# EAGLE design main_board (EAGLE 9.3.0)
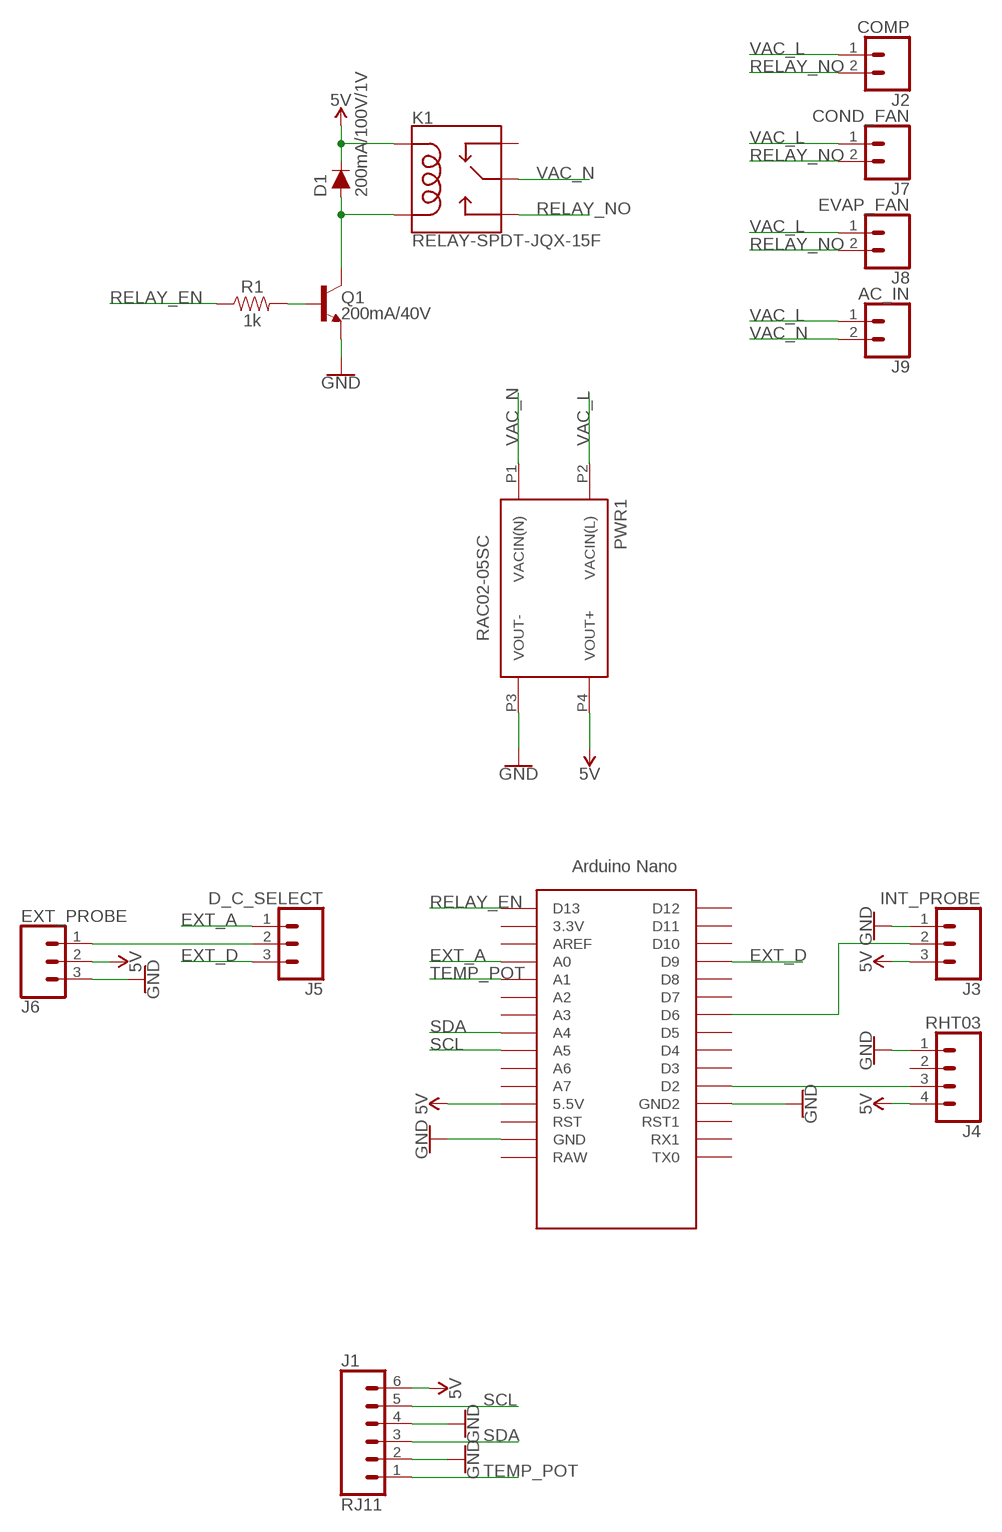
[diagram p0: schematic, sheet 1]

## Parts
D1  200mA/100V/1V  DIODE-1N4148  [DIODE-1N4148]
J1  RJ11  RJ11-6  [RJ11-6]
J2  COMP  CONN_025MM  [SCREWTERMINAL-5MM-2]
J3  INT_PROBE  CONN_03  [1X03]
J4  RHT03  CONN_04  [1X04]
J5  D_C_SELECT  CONN_03  [1X03]
J6  EXT_PROBE  CONN_03  [1X03]
J7  COND_FAN  CONN_025MM  [SCREWTERMINAL-5MM-2]
J8  EVAP_FAN  CONN_025MM  [SCREWTERMINAL-5MM-2]
J9  AC_IN  CONN_025MM  [SCREWTERMINAL-5MM-2]
K1  RELAY-SPDT-JQX-15F  [RELAY-T90]
PWR1  RAC02-05SC  [LOW_PROFILE_POWER_MODULE]
Q1  200mA/40V  TRANS_NPN-2N3904  [TO-92]
R1  1k  1KOHM-HORIZ-1/4W-1%  [AXIAL-0.3]
U$1  NANO  [NANO]

## Nets
5V: D1.C J1.6 J3.3 J4.4 J6.2 K1.COIL1 PWR1.P4(VOUT+) U$1.5V(5.5V)
EXT_A: J5.1 U$1.A0
EXT_D: J5.3 U$1.D9
GND: J1.2 J1.4 J3.1 J4.1 J6.3 PWR1.P3(VOUT-) Q1.1(E) U$1.GND U$1.GND1(GND2)
N$1: Q1.2(B) R1.P$2
N$2: D1.A K1.COIL2 Q1.3(C)
N$3: J4.3 U$1.D2
N$4: J3.2 U$1.D6
N$7: J5.2 J6.1
RELAY_EN: R1.P$1 U$1.D13
RELAY_NO: J2.2 J7.2 J8.2 K1.NO
SCL: J1.5 U$1.A5
SDA: J1.3 U$1.A4
TEMP_POT: J1.1 U$1.A1
VAC_L: J2.1 J7.1 J8.1 J9.1 PWR1.P2(VACIN(L))
VAC_N: J9.2 K1.MAIN PWR1.P1(VACIN(N))
Unconnected: J4.2 K1.NC U$1.3.3V U$1.A2 U$1.A3 U$1.A6 U$1.A7 U$1.AREF U$1.D3 U$1.D4 U$1.D5 U$1.D7 U$1.D8 U$1.D10 U$1.D11 U$1.D12 U$1.ICSP1 U$1.ICSP2 U$1.ICSP3 U$1.ICSP4 U$1.ICSP5 U$1.ICSP6 U$1.RAW U$1.RST U$1.RST1 U$1.RX1 U$1.TX0

## Library data of the parts
D1 = SparkFun-DiscreteSemi:DIODE: Diode These are standard reverse protection diodes and small signal diodes. SparkFun Products: SparkFun SparkPunk Sound Kit <https://www.sparkfun.com/products/11177> SparkFun ESP8266 Thing <https://www.sparkfun.com/products/13231>; PROD_ID: DIO-08378
J1 = SparkFun-Connectors:RJ11-6: RJ11 Jack - 6 pin Commonly found on CAT3 devices and some Microchip programmers. Here is the connector we sell at SparkFun: RJ11 6-Pin Connector <https://www.sparkfun.com/products/132> (PRT-00132) Datasheet <http://www.sparkfun.com/datasheets/Prototyping/Connectors/RJ11-Datasheet.pdf> It is used on this SparkFun product: SparkFun Weather Shield <https://www.sparkfun.com/products/12081> (DEV-12081) Weather Meters <https://www.sparkfun.com/products/8942> (SEN-08942); PROD_ID: CONN-08590; SF_ID: PRT-00132
J2 J7-J9 = SparkFun-Connectors:CONN_02: Multi connection point. Often used as Generic Header-pin footprint for 0.1 inch spaced/style header connections On any of the 0.1 inch spaced packages, you can populate with these: Break Away Headers - Straight <https://www.sparkfun.com/products/116> (PRT-00116) Break Away Male Headers - Right Angle <https://www.sparkfun.com/products/553> (PRT-00553) Female Headers <https://www.sparkfun.com/products/115> (PRT-00115) Break Away Headers - Machine Pin <https://www.sparkfun.com/products/117> (PRT-00117) Break Away Female Headers - Swiss Machine Pin <https://www.sparkfun.com/products/743> (PRT-00743) For SCREWTERMINALS and SPRING TERMINALS visit here: Screw Terimnals on SparkFun.com <https://www.sparkfun.com/search/results?term=Screw+Terminals> (5mm/3.5mm/2.54mm spacing) This device is also useful as a general connection point to wire up your design to another part of your project. Our various solder wires solder well into these plated through hole pads. Hook-Up Wire - Assortment (Stranded, 22 AWG) <https://www.sparkfun.com/products/11375> (PRT-11375) Hook-Up Wire - Assortment (Solid Core, 22 AWG) <https://www.sparkfun.com/products/11367> (PRT-11367) View the entire wire category on our website here <https://www.sparkfun.com/categories/141> Special notes: Molex polarized connector foot print use with: PRT-08233 with associated crimp pins and housings. 2.54_SCREWTERM for use with PRT-10571. 3.5mm Screw Terminal footprints for PRT-08084 5mm Screw Terminal footprints for use with PRT-08432; SF_SKU: PRT-08432
J3 J5 J6 = SparkFun-Connectors:CONN_03: Multi connection point. Often used as Generic Header-pin footprint for 0.1 inch spaced/style header connections On any of the 0.1 inch spaced packages, you can populate with these: Break Away Headers - Straight <https://www.sparkfun.com/products/116> (PRT-00116) Break Away Male Headers - Right Angle <https://www.sparkfun.com/products/553> (PRT-00553) Female Headers <https://www.sparkfun.com/products/115> (PRT-00115) Break Away Headers - Machine Pin <https://www.sparkfun.com/products/117> (PRT-00117) Break Away Female Headers - Swiss Machine Pin <https://www.sparkfun.com/products/743> (PRT-00743) Stackable Header - 3 Pin (Female, 0.1") <https://www.sparkfun.com/products/13875> (PRT-13875) For SCREWTERMINALS and SPRING TERMINALS visit here: Screw Terimnals on SparkFun.com <https://www.sparkfun.com/search/results?term=Screw+Terminals> (5mm/3.5mm/2.54mm spacing) This device is also useful as a general connection point to wire up your design to another part of your project. Our various solder wires solder well into these plated through hole pads. Hook-Up Wire - Assortment (Stranded, 22 AWG) <https://www.sparkfun.com/products/11375> (PRT-11375) Hook-Up Wire - Assortment (Solid Core, 22 AWG) <https://www.sparkfun.com/products/11367> (PRT-11367) View the entire wire category on our website here <https://www.sparkfun.com/categories/141> Special notes: Molex polarized connector foot print use with SKU : PRT-08232 with associated crimp pins and housings.; PROD_ID: XXX-00000; VALUE: 455-1750-1-ND
J4 = SparkFun-Connectors:CONN_04: Multi connection point. Often used as Generic Header-pin footprint for 0.1 inch spaced/style header connections On any of the 0.1 inch spaced packages, you can populate with these: Break Away Headers - Straight <https://www.sparkfun.com/products/116> (PRT-00116) Break Away Male Headers - Right Angle <https://www.sparkfun.com/products/553> (PRT-00553) Female Headers <https://www.sparkfun.com/products/115> (PRT-00115) Break Away Headers - Machine Pin <https://www.sparkfun.com/products/117> (PRT-00117) Break Away Female Headers - Swiss Machine Pin <https://www.sparkfun.com/products/743> (PRT-00743) For SCREWTERMINALS and SPRING TERMINALS visit here: Screw Terimnals on SparkFun.com <https://www.sparkfun.com/search/results?term=Screw+Terminals> (5mm/3.5mm/2.54mm spacing) This device is also useful as a general connection point to wire up your design to another part of your project. Our various solder wires solder well into these plated through hole pads. Hook-Up Wire - Assortment (Stranded, 22 AWG) <https://www.sparkfun.com/products/11375> (PRT-11375) Hook-Up Wire - Assortment (Solid Core, 22 AWG) <https://www.sparkfun.com/products/11367> (PRT-11367) View the entire wire category on our website here <https://www.sparkfun.com/categories/141> Special notes: Molex polarized connector foot print use with SKU : PRT-08231 with associated crimp pins and housings. 1MM SMD Version SKU: PRT-10208; PROD_ID: CONN-09696
K1 = SparkFun-Electromechanical:RELAY-SPDT: SPDT Electromechanical Relay Single-pole, double-throw sealed relays. When current is applied to the coil, it throws a simple changeover switch, terminating the connection from the NC contact to ground and closing the NO contact. Use them to switch high voltage/high current devices. SparkFun Products JQX-15F: Relay SPDT Sealed - 20A <https://www.sparkfun.com/products/10924> (COM-10924) JZC-11F: Relay SPDT Sealed <https://www.sparkfun.com/products/100> (COM-00100); PROD_ID: COMP-10736; SF_SKU: COM-10924
PWR1 = recom-powerline-acdc-converters:RAC*SC: RECOM POWERLINE AC/DC-Converter (RAC01-SC and RAC02-SC series) The RAC01-SC and RAC02-SC series are ultra-compact universal input AC/DC power modules for PCB mounting. They feature high efficiency, low standby power, high operating temperature, soft start and short-circuit protection as well as a built-in EMC Class B filter. Output voltages range from 3.3VDC to 24VDC. Datasheet <http://www.recom-power.com/pdf/Powerline-AC-DC/RAC01_02-SC.pdf>; INPUT_RANGE: 80 - 277 (VAC); MAX_CAPACITIVE_LOAD: 1200uF; OUTPUT_CURRENT: 400mA; OUTPUT_VOLTAGE: 5v
Q1 = SparkFun-DiscreteSemi:TRANS_NPN: NPN transistor Current controlled devices typically used to amplify current or used as a switch. BC547 - COM-08928 <http://www.sparkfun.com/products/8928> (TO-92 45V 100mA) (1.Collector 2.Base 3.Emitter) 2N3904 - COM-00521 <http://www.sparkfun.com/products/521> (TO-92 40V 200mA) (1.Emitter 2.Base 3.Collector) P2N2222A - COM-12852 <http://www.sparkfun.com/products/12852> (TO-92 40V 600mA) (1.Collector 2.Base 3.Emitter); PROD_ID: TRANS-08447
R1 = SparkFun-Resistors:1KOHM: 1kΩ resistor A resistor is a passive two-terminal electrical component that implements electrical resistance as a circuit element. Resistors act to reduce current flow, and, at the same time, act to lower voltage levels within circuits. - Wikipedia; PROD_ID: RES-12182
U$1 = Arduino-clone:NANO: Arduino Nano

## Board
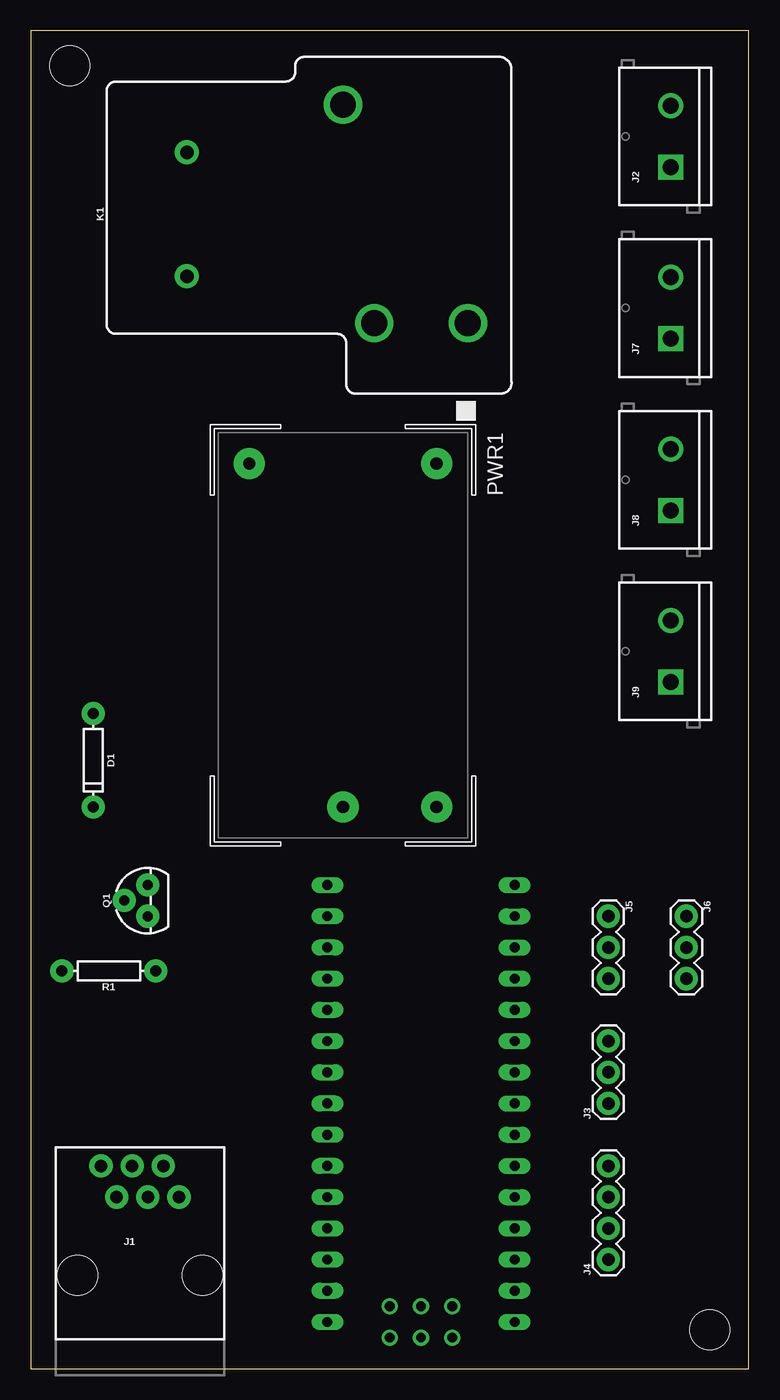
[diagram p1: board, top side]
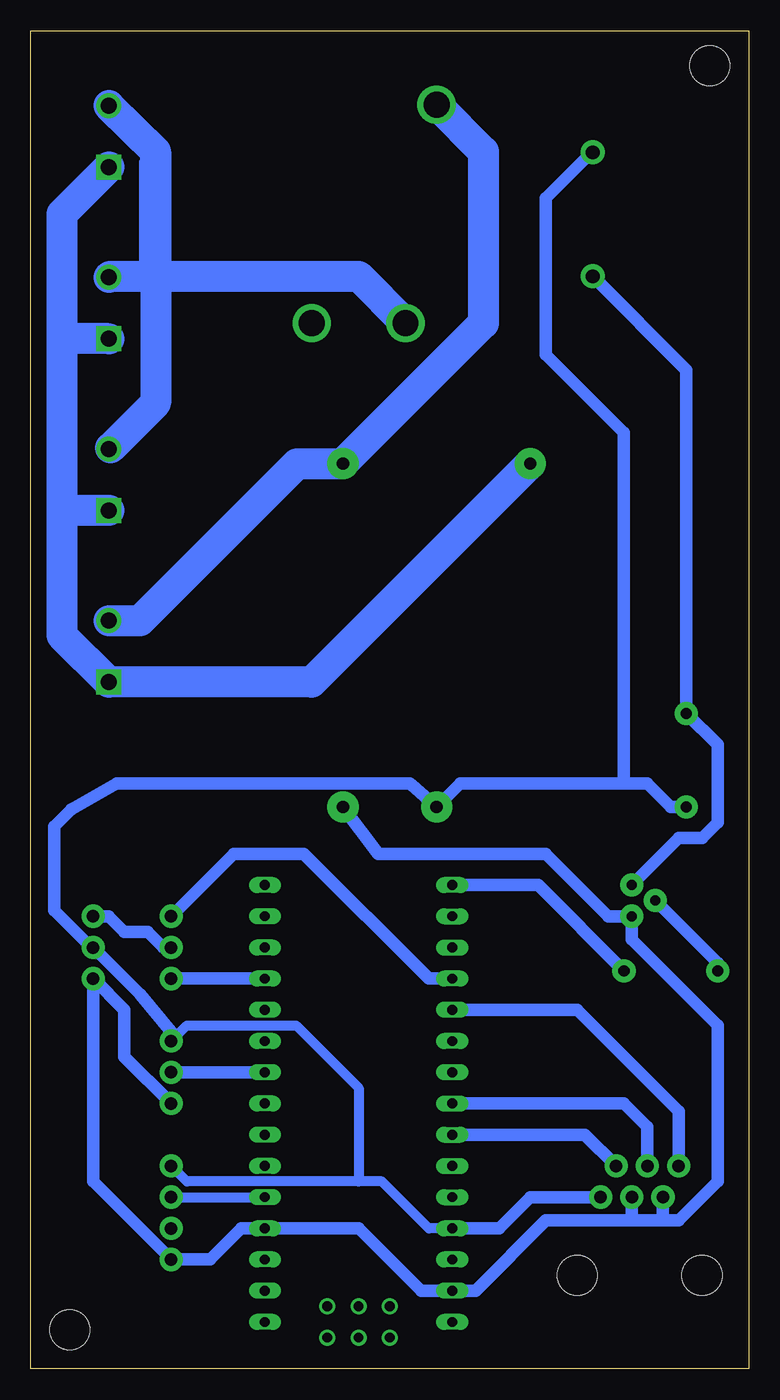
[diagram p2: board, bottom side, seen from below]

Size 58.4 x 108.89 mm. Coordinates in mm from the lower left corner, seen from the top.
Outline: 0,0 58.4,0 58.4,108.89 0,108.89 0,0
Copper layers (1*16): Top 0.035mm / dielectric 1.5mm / Bottom 0.035mm
Design rules "default": minimum track width 6mil, minimum drill 0.35mm, track to track 6mil, track to pad 6mil, pad to pad 6mil, via to via 6mil, smd to smd 6mil, copper to edge 40mil, drill to drill 6mil, minimum pad ring 10mil, minimum via ring 8mil, stop-mask expansion 4mil, vias tented up to drill 0mil, thermal gap 10mil
Holes 3.25 mm at 55.24,3.17 3.17,106.05

### Footprints (pad centres in the part's own frame; a part is rotated, then mirrored left to right if it is on the bottom)
DIODE-1N4148 = drill 0.9 pad 1.88: A -3.81,0; C 3.81,0
RJ11-6 = drill 1.016 pad 1.88: 1 -3.175,8.89; 2 -1.905,6.35; 3 -0.635,8.89; 4 0.635,6.35; 5 1.905,8.89; 6 3.175,6.35 | hole 3.251: -5.08,0; 5.08,0
SCREWTERMINAL-5MM-2 = drill 1.3 pad 2.032 square: 1 0,0 | drill 1.3 pad 2.032: 2 5,0
1X03 = drill 1.016 pad 1.88: 1 0,0; 2 2.54,0; 3 5.08,0
1X04 = drill 1.016 pad 1.88: 1 0,0; 2 2.54,0; 3 5.08,0; 4 7.62,0
RELAY-T90 = drill 1.1 pad 1.956: COIL1 0,-13.9; COIL2 0,-3.81 | drill 2.1: MAIN -12.7,-17.78; NC -22.86,0; NO -15.24,0
LOW_PROFILE_POWER_MODULE = drill 1 pad 2.54: P1 -12.7,7.62; P2 -12.7,-7.62; P3 15.24,7.62; P4 15.24,0
TO-92 = drill 0.813 pad 1.88: 1 -1.27,0; 2 0,1.905; 3 1.27,0
AXIAL-0.3 = drill 0.9 pad 1.88: P$1 -3.81,0; P$2 3.81,0
NANO = drill 0.8 long: 3.3V -10.16,24.13; 5V -10.16,-1.27; A0 -10.16,19.05; A1 -10.16,16.51; A2 -10.16,13.97; A3 -10.16,11.43; A4 -10.16,8.89; A5 -10.16,6.35; A6 -10.16,3.81; A7 -10.16,1.27; AREF -10.16,21.59; D2 5.08,1.27; D3 5.08,3.81; D4 5.08,6.35; D5 5.08,8.89; D6 5.08,11.43; D7 5.08,13.97; D8 5.08,16.51; D9 5.08,19.05; D10 5.08,21.59; D11 5.08,24.13; D12 5.08,26.67; D13 -10.16,26.67; GND -10.16,-6.35; GND1 5.08,-1.27; RAW -10.16,-8.89; RST -10.16,-3.81; RST1 5.08,-3.81; RX1 5.08,-6.35; TX0 5.08,-8.89 | drill 0.8: ICSP1 -5.08,-10.16; ICSP2 -5.08,-7.62; ICSP3 -2.54,-10.16; ICSP4 -2.54,-7.62; ICSP5 0,-10.16; ICSP6 0,-7.62

### Placement (x,y rotation side)
D1  5.08,49.53 270 top
DRILEGEND  [DRILEGEND]  0,-4.42 0 top  (outside the outline)
J1  8.89,7.62 0 top
J2  52.07,97.79 90 top
J3  46.99,21.59 90 top
J4  46.99,8.89 90 top
J5  46.99,36.83 270 top
J6  53.34,36.83 270 top
J7  52.07,83.82 90 top
J8  52.07,69.85 90 top
J9  52.07,55.88 90 top
K1  12.7,85.09 180 top
PWR1  25.4,60.96 270 top
Q1  9.53,38.1 90 top
R1  6.35,32.38 180 top
U$1  34.29,12.7 0 top

### Tracks (layer width: path | path; a pad name or v marks a point on that pad's centre or on a via)
5V
  Bottom 0.152: 53.49,34.29 J6.2 | 25.45,45.72 PWR1.P4
  Bottom 0.254: K1.COIL1 12.77,98.99 | 27.42,47.49 27.58,47.62 | 55.13,45.52 55.24,45.45
  Bottom 0.813: U$1.5V 26.04,11.43 29.84,15.24 31.75,15.24 | J4.4 45.72,15.24 31.75,15.24 | J3.3 45.72,27.94 36.83,27.94 31.75,22.86 31.75,15.24
  Bottom 1.016: 12.77,98.99 16.51,95.25 16.51,82.55 10.16,76.2 10.16,47.62 | D1.C 6.35,45.72 8.26,47.62 10.16,47.62 | 10.16,47.62 23.5,47.62 PWR1.P4 27.42,47.49 | U$1.5V 20.32,11.43 17.78,13.97 J1.6 | J6.2 49.53,30.48 46.99,27.43 J3.3 | 27.58,47.62 51.44,47.62 55.13,45.52 56.52,44.13 56.52,37.31 53.49,34.29
EXT_A
  Bottom 1.016: U$1.A0 26.04,31.75 36.2,41.91 41.91,41.91 J5.1
EXT_D
  Bottom 1.016: U$1.D9 J5.3
GND
  Bottom 0.152: 9.6,36.88 Q1.1
  Bottom 1.016: J3.1 50.8,25.4 50.8,29.21 J6.3 53.34,15.24 J4.1 43.81,8.89 41.27,11.43 U$1.GND1 31.75,11.43 26.67,6.35 U$1.GND 22.23,6.35 16.51,12.06 9.53,12.06 | PWR1.P3 30.16,41.91 16.51,41.91 11.43,36.83 Q1.1 9.53,34.92 2.54,27.94 2.54,15.24 5.71,12.06 6.99,12.06 | J1.4 9.53,12.06 | 6.99,12.06 9.53,12.06 | J1.2 6.99,12.06
N$1
  Bottom 1.016: Q1.2 2.54,33.02 R1.P$2
N$2
  Bottom 1.016: K1.COIL2 5.08,81.28 D1.A 2.54,50.8 2.54,44.45 3.81,43.18 5.71,43.18 Q1.3
N$3
  Bottom 0.813: J4.3 U$1.D2
N$4
  Bottom 1.016: J3.2 U$1.D6
N$7
  Bottom 1.016: J6.1 52.07,36.83 50.8,35.56 48.9,35.56 47.62,34.29 J5.2
RELAY_EN
  Bottom 1.016: R1.P$1 17.14,39.37 U$1.D13
RELAY_NO
  Bottom 0.152: J8.2 52.12,74.83 51.92,74.93 | 49.53,88.9 49.53,98.3 49.38,98.45 48.26,98.45
  Bottom 2.54: J2.2 48.26,99.06 48.26,98.45 48.26,88.9 | 48.26,88.9 48.26,78.59 51.92,74.93 | J7.2 51.99,88.9 49.53,88.9 | 48.26,88.9 31.75,88.9 K1.NO
SCL
  Bottom 1.016: J1.5 13.34,19.05 U$1.A5
SDA
  Bottom 1.016: J1.3 8.26,19.68 10.16,21.59 U$1.A4
TEMP_POT
  Bottom 1.016: U$1.A1 13.97,29.21 5.71,20.95 J1.1
VAC_L
  Bottom 2.54: J2.1 55.88,93.98 55.88,83.82 | 55.88,83.82 55.88,69.85 | 55.88,69.85 55.88,59.69 J9.1 35.56,55.88 PWR1.P2 | J7.1 55.88,83.82 | J8.1 55.88,69.85
VAC_N
  Bottom 0.152: J9.2 52.12,60.96 52.73,61.57
  Bottom 2.54: K1.MAIN 21.59,99.06 21.59,85.09 PWR1.P1 36.75,73.66 49.53,60.88 J9.2 51.92,60.88

### Text on the board
DrillLegend: LAYER-STACK
DrillLegend_01-16: 01-16
DrillLegend_01-20: 01-20